# EasyEDA Pro project 5轴PCB-V1.1--捷配.eprj, board PCB
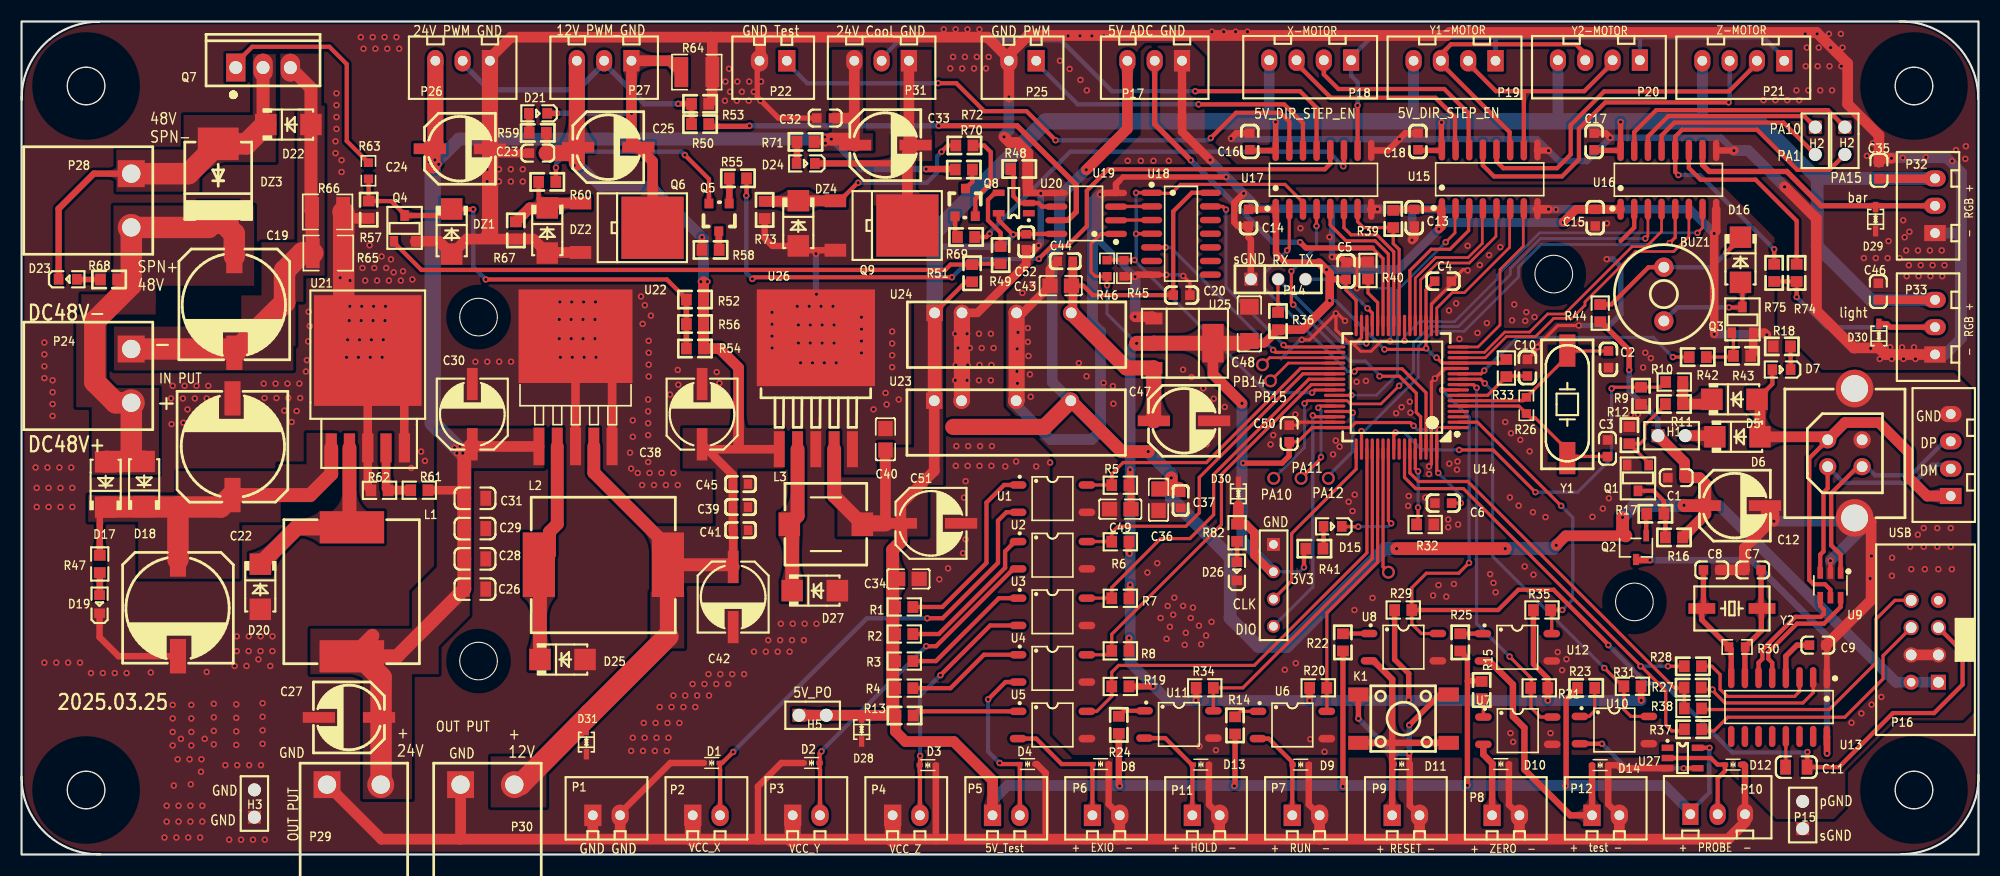
[diagram p2: board, top side]
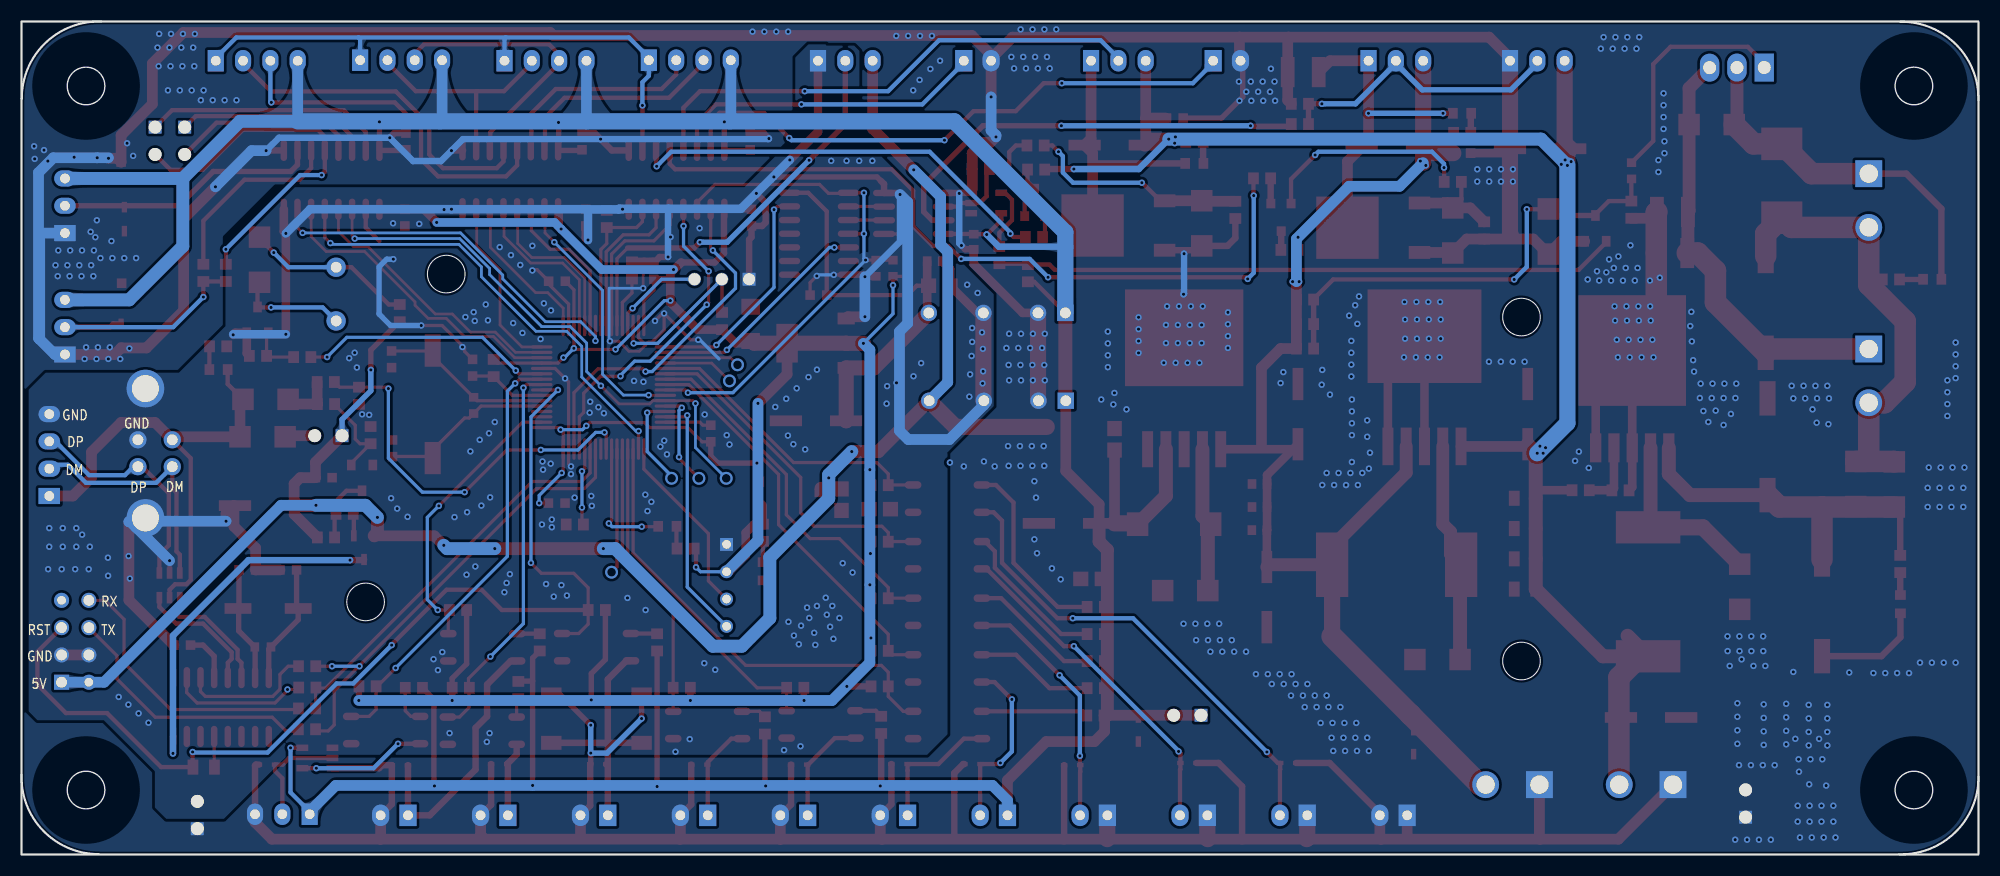
[diagram p3: board, bottom side, seen from below]

Outline 182.01 x 77.5 mm; copper layers: Top Layer, Bottom Layer. Coordinates in mm from the lower left corner of the outline.
Outline path: rectangle 0.01,77.5 182.01,0 ; circle c6.01,71.5 r1.75 ; circle c6.01,6 r1.75 ; circle c42.51,50 r1.75 ; circle c42.51,18 r1.75 ; circle c142.51,54 r1.75 ; circle c150.01,23.5 r1.75 ; circle c176.01,71.5 r1.75 ; circle c176.01,6 r1.75 ; 0.01,70.15 arc(2.08,75.35) 7.26,77.48 ; 7.37,0.02 arc(2.15,2.08) 0,7.25 ; 174.63,77.5 arc(179.84,75.45) 181.99,70.29 ; 182.01,7.41 arc(179.98,2.2) 174.81,0.03
Stack: Top Layer 0.035mm / Dielectric1 1.51mm FR4 er 4.5 / Bottom Layer 0.035mm

## Design rules (mm)
net USB_DP_1: DP1
net USB_DM_1: DP1
template: 用户自定义配置
spacing Default (default): track to track 0.152, other pairs 0 to 0.152
track width Default (default): min 0.254, default 0.254, max 25.4
differential pair differentialPair (default): width min 0.127, default 0.254, max 2.54; gap min 0.152, default 0.152
via Default (default): diameter min 0.25, default 0.61, max 100.025; hole min 0.2, default 0.305, max 59.995

## Placement (name value [footprint] x y rotation side)
BUZ1  HNR-1255PA5.0  [BUZ-TH_BD12.5-P5.00-D0.9]  152.75 52.14 270 top
C1  104  [0603C]  153.89 35.06 0 top
C2  100pF  [0603C]  147.59 46.07 270 top
C3  100pF  [0603C]  147.5 37.79 90 top
C4  104  [0603C]  132.21 53.34 180 top
C5  104  [0603C]  123.19 54.29 270 top
C6  104  [0603C]  132.23 32.69 0 top
C7  18pF  [0603C]  161.01 26.48 180 top
C8  18pF  [0603C]  157.2 26.48 0 top
C9  104  [0603C]  167.06 19.48 0 top
C10  104  [0603C]  140.06 45.29 270 top
C11  104  [0805C]  165.06 8.13 0 top
C12  100uF/35V  [电解电容贴片6X6]  159.35 32.46 0 top
C13  104  [0603C]  129.53 59.25 270 top
C14  104  [0603C]  114.12 59.25 270 top
C15  104  [0603C]  146.36 59.25 270 top
C16  104  [0603C]  114.24 66.34 270 top
C17  104  [0603C]  146.26 66.34 270 top
C18  104  [0603C]  129.88 66.34 270 top
C19  100uF/63V  [电解电容贴片10x10]  19.69 51.44 270 top
C20  104  [0603C]  107.89 52.04 180 top
C21  100uF/63V  [电解电容贴片10x10]  19.72 37.68 90 top
C22  100uF/63V  [电解电容贴片10x10]  14.46 23.21 270 top
C23  104  [0603C]  48.02 65.25 0 top
C24  100uF/35V  [电解电容贴片6X6]  40.77 65.66 0 top
C25  100uF/35V  [电解电容贴片6X6]  54.57 65.81 0 top
C26  104  [0805C]  42.18 24.69 180 top
C27  100uF/35V  [电解电容贴片6X6]  30.45 12.75 180 top
C28  105  [0805C]  42.18 27.51 0 top
C29  105  [0805C]  42.18 30.32 0 top
C30  100uF/35V  [电解电容贴片6x6]  41.93 40.97 90 top
C31  105  [0805C]  42.18 33.14 180 top
C32  104  [0603C]  74.74 68.52 0 top
C33  100uF/35V  [电解电容贴片6X6]  80.34 66 0 top
C34  4.7uF  [C0805]  82.49 25.64 180 top
C35  104  [0603C]  172.75 63.65 270 top
C36  4.7uF  [C0805]  105.75 33.01 90 top
C37  104  [C0603]  107.81 32.95 90 top
C38  100uF/35V  [电解电容贴片6x6]  63.3 40.97 90 top
C39  104  [C0603]  66.87 32.33 180 top
C40  4.7uF  [C0805]  80.35 38.63 270 top
C41  105  [C0603]  66.88 30.18 0 top
C42  100uF/35V  [电解电容贴片6x6]  66.19 23.95 270 top
C43  4.7uF  [C0805]  96.65 52.92 0 top
C44  104  [C0603]  97.08 55.2 0 top
C45  105  [C0603]  66.87 34.47 180 top
C46  104  [0603C]  172.69 52.38 270 top
C47  100uF/35V  [电解电容贴片6X6]  108.12 40.35 0 top
C48  4.7uF  [C1206]  114.2 49.37 270 top
C49  4.7uF  [C0805]  102.19 32.13 0 top
C50  104  [0603C]  117.9 39.17 270 top
C51  100uF/35V  [电解电容贴片6x6]  84.59 30.81 0 top
C52  104  [C0603]  93.45 57.01 90 top
D1  ESD05V52D-C  [SOD-523_L1.2-W0.8-LS1.6-BI]  64.19 8.52 180 top
D2  ESD05V52D-C  [SOD-523_L1.2-W0.8-LS1.6-BI]  73.48 8.52 180 top
D3  ESD05V52D-C  [SOD-523_L1.2-W0.8-LS1.6-BI]  84.29 8.31 0 top
D4  ESD05V52D-C  [SOD-523_L1.2-W0.8-LS1.6-BI]  93.57 8.41 0 top
D5  SS56  [SMA]  159.31 42.35 0 top
D6  SS56  [SMA]  159.59 38.86 0 top
D7  红光  [0603LED]  163.72 45.14 0 top
D8  ESD05V52D-C  [SOD-523_L1.2-W0.8-LS1.6-BI]  100.35 8.41 180 top
D9  ESD05V52D-C  [SOD-523_L1.2-W0.8-LS1.6-BI]  118.97 8.36 180 top
D10  ESD05V52D-C  [SOD-523_L1.2-W0.8-LS1.6-BI]  137.59 8.41 180 top
D11  ESD05V52D-C  [SOD-523_L1.2-W0.8-LS1.6-BI]  128.37 8.4 180 top
D12  ESD05V52D-C  [SOD-523_L1.2-W0.8-LS1.6-BI]  159.18 8.36 180 top
D13  ESD05V52D-C  [SOD-523_L1.2-W0.8-LS1.6-BI]  109.69 8.36 180 top
D14  ESD05V52D-C  [SOD-523_L1.2-W0.8-LS1.6-BI]  146.82 8.31 180 top
D15  绿光  [0603LED]  121.98 30.55 0 top
D16  1N4148  [SMA]  159.87 55.34 270 top
D17  SS56  [SMA]  7.83 34.43 90 top
D18  SS56  [SMA]  11.41 34.47 90 top
D19  红光  [0603LED]  7.28 23.26 270 top
D20  SS56  [SMA]  22.21 24.91 270 top
D21  绿光  [0603LED]  48.07 68.98 0 top
D22  SS56  [SMA]  24.82 67.91 0 top
D23  -̹-  [0603LED]  4.27 53.5 180 top
D24  绿光  [0603LED]  72.97 64.31 0 top
D25  SS56  [SMA]  50.32 18.14 0 top
D26  红光  [0603LED]  113.05 26.32 270 top
D27  SS56  [SMA]  73.78 24.55 0 top
D28  PESD5V0S1BLN  [SOD-323_L1.8-W1.3-LS2.5-BI]  78.14 11.63 270 top
D29  PESD5V0S1BLN  [SOD-323_L1.8-W1.3-LS2.5-BI]  172.44 59.11 270 top
D30  PESD5V0L1BA-N  [SOD-323_L1.8-W1.3-LS2.5-BI]  172.75 48.25 270 top
D30#2  -  [SOD-323_L1.8-W1.3-LS2.5-BI]  113.18 33.56 90 top
D31  PESD3V3L1BA-N  [SOD-323_L1.8-W1.3-LS2.5-BI]  52.54 10.46 270 top
DZ1  --ѹ------SMAZ10V  [SMA]  40.01 57.96 270 top
DZ2  --ѹ------SMAZ10V  [SMA]  48.9 58.06 270 top
DZ3  RS5M  [SMC]  18.29 62.68 90 top
DZ4  --ѹ------SMAZ10V  [SMA]  72.24 58.72 270 top
H1  PZ254V-11-02P  [HDR-TH_2P-P2.54-V-M]  153.47 38.96 0 top
H2  PZ254V-11-02P  [HDR-TH_2P-P2.54-V-M]  169.58 66.4 270 top
H2#2  -  [HDR-TH_2P-P2.54-V-M]  166.83 66.4 270 top
H3  PZ254V-11-02P  [HDR-TH_2P-P2.54-V-M]  21.66 4.74 90 top
H5  PZ254V-11-02P  [HDR-TH_2P-P2.54-V-M]  73.58 12.95 0 top
K1  SW_6X6_H=12.0MM  [KEY-SMD_4P-L6.0-W6.0-P4.50-LS9.0]  128.54 12.64 0 top
L1  47uH/5A  [IND-SMD_L13.45-W12.6]  30.73 24.44 270 top
L2  33uH  [IND-SMD_L13.45-W12.6]  54.12 26.96 0 top
L3  33uH  [IND-SMD_L7.0-W7.0_SMDRI74-330MT]  74.81 30.73 0 top
NOREF  -  [USB-B-TH_USB-B12-BRW]  169.58 37.33 90 top
P1  2P  [HDR1X2_CON]  54.41 3.65 0 top
P2  2P  [HDR1X2_CON]  63.7 3.65 0 top
P3  2P  [HDR1X2_CON]  72.99 3.65 0 top
P4  2P  [HDR1X2_CON]  82.29 3.65 0 top
P5  2P  [HDR1X2_CON]  91.58 3.65 0 top
P6  2P  [HDR1X2_CON]  100.87 3.65 0 top
P7  2P  [HDR1X2_CON]  119.46 3.65 0 top
P8  2P  [HDR1X2_CON]  138.04 3.65 0 top
P9  2P  [HDR1X2_CON]  128.75 3.65 0 top
P10  2P  [HDR1X3_CON]  157.75 3.75 0 top
P11  2P  [HDR1X2_CON]  110.16 3.65 0 top
P12  2P  [HDR1X2_CON]  147.34 3.65 0 top
P14  PZ254V-11-03P  [HDR-TH_3P-P2.54-V-M]  116.88 53.52 0 top
P15  PZ254V-11-03P  [HDR-TH_2P-P2.54-V-M]  165.66 3.67 90 top
P16  8P  [IDC8]  177.26 19.84 90 top
P17  3P  [HDR1X3_CON]  105.39 73.85 180 top
P18  4P  [HDR1X4_CON]  123.66 73.9 180 top
P19  4P  [HDR1X4_CON]  137.09 73.85 180 top
P20  4P  [HDR1X4_CON]  150.51 73.9 180 top
P21  4P  [HDR1X4_CON]  163.94 73.85 180 top
P22  2P  [HDR1X2_CON]  69.91 73.85 180 top
P23  4P  [SIP4]  116.44 28.85 270 top
P24  DB2ER-5.0-2P-GN  [CONN-TH_2P-P5.00_DB2ER-5.0-2P-GN]  10.21 44.53 270 top
P25  2P  [HDR1X2_CON]  93.1 73.85 180 top
P26  3P  [HDR1X3_CON]  41.03 73.85 180 top
P27  3P  [HDR1X3_CON]  54.19 73.85 180 top
P28  DB2ER-5.0-2P-GN  [CONN-TH_2P-P5.00_DB2ER-5.0-2P-GN]  10.21 60.84 270 top
P29  DB2ER-5.0-2P-GN  [CONN-TH_2P-P5.00_DB2ER-5.0-2P-GN]  30.91 6.5 0 top
P30  DB2ER-5.0-2P-GN  [CONN-TH_2P-P5.00_DB2ER-5.0-2P-GN]  43.34 6.5 0 top
P31  3P  [HDR1X3_CON]  79.99 73.85 180 top
P32  3P  [HDR1X3_CON]  177.97 60.36 90 top
P33  3P  [HDR1X3_CON]  177.97 49.06 90 top
Q1  SS8050  [SOT-23]  150.34 35.04 180 top
Q2  AO3401  [SOT-23-3_L3.0-W1.7-P0.95-LS2.9-BR]  150.15 28.55 90 top
Q3  SS8050  [SOT-23]  160.06 49.74 0 top
Q4  SS8050  [SOT-23]  35.63 58.25 0 top
Q5  SS8050  [SOT-23#2]  65.82 60.56 180 top
Q6  F50N06 (FR9024N)  [TO-252]  54.59 58.31 270 top
Q7  IRFB4110PBF/不贴  [TO-220-3_L10.0-W4.5-P2.54-L]  22.47 73.21 0 top
Q8  SS8050  [SOT-23#2]  86.83 59.39 0 top
Q9  F50N06 (FR9024N)  [TO-252]  78.29 58.52 270 top
R1  1K  [0603R]  82.1 23.03 0 top
R2  1K  [0603R]  82.1 20.51 0 top
R3  1K  [0603R]  82.1 17.99 0 top
R4  1K  [0603R]  82.1 15.47 0 top
R5  10K  [0603R]  102.2 34.36 180 top
R6  10K  [0603R]  102.2 29.1 180 top
R7  10K  [0603R]  102.2 23.84 180 top
R8  10K  [0603R]  102.2 18.95 180 top
R9  10K  [0603R]  150.62 42.68 270 top
R10  5.1K  [0603R]  153.71 43.96 180 top
R11  2K  [0603R]  153.69 41.91 0 top
R12  10K  [0603R]  149.54 39.02 270 top
R13  1K  [0603R]  82.13 12.93 0 top
R14  1K  [0603R]  112.87 12.01 90 top
R15  1K  [0603R]  135.8 15.3 270 top
R16  10K  [0603R]  153.69 29.5 0 top
R17  1K  [0603R]  151.96 31.69 0 top
R18  20K  [0603R]  163.72 47.28 180 top
R19  10K  [0603R]  102.2 15.64 180 top
R20  10K  [0603R]  120.6 15.5 0 top
R21  10K  [0603R]  141.16 15.5 180 top
R22  1K  [0603R]  122.9 19.74 90 top
R23  1K  [0603R]  145.52 15.5 0 top
R24  1K  [0603R]  102.06 12.06 90 top
R25  1K  [0603R]  133.81 19.74 90 top
R26  1M  [R0603]  139.96 41.78 90 top
R27  510Ω  [0603R]  155.42 15.53 180 top
R28  510Ω  [0603R]  155.44 17.52 180 top
R29  10K  [0603R]  128.51 22.75 0 top
R30  1M  [R0603]  159.56 19.31 0 top
R31  10K  [0603R]  149.83 15.65 180 top
R32  10K  [0603R]  130.55 30.7 180 top
R33  10K  [0603R]  138.1 45.26 270 top
R34  10K  [0603R]  110.04 15.5 0 top
R35  10K  [0603R]  141.41 22.75 0 top
R36  10K  [0603R]  116.86 49.63 270 top
R37  510Ω  [0603R]  155.46 11.65 0 top
R38  510Ω  [0603R]  155.45 13.59 0 top
R39  10K  [0603R]  127.58 59.13 90 top
R40  10K  [0603R]  125.23 54.34 90 top
R41  50K  [0603R]  120.24 28.46 180 top
R42  2K  [0603R]  155.9 46.28 180 top
R43  10K  [0603R]  160.02 46.39 0 top
R44  5.1K  [0603R]  146.83 50.37 270 top
R45  10K  [R0603]  102.54 54.54 90 top
R46  10K  [R0603]  100.96 54.54 270 top
R47  10K  [0603R]  7.28 27.03 90 top
R48  10K  [0603R]  92.8 63.77 0 top
R49  100  [0603R]  91.06 55.77 270 top
R50  100  [0603R]  63.11 67.95 180 top
R51  10K  [0603R]  88.41 54.08 270 top
R52  20K  [0603R]  62.64 51.63 0 top
R53  10K  [0603R]  63.11 69.84 180 top
R54  20K  [0603R]  62.64 47.07 0 top
R55  2K  [0603R]  66.63 62.91 0 top
R56  20K  [0603R]  62.64 49.35 0 top
R57  10K  [0603R]  32.29 59.99 270 top
R58  20K  [0603R]  64.08 56.25 180 top
R59  50K  [0603R]  48.02 67.14 180 top
R60  0Ω  [0603R]  48.89 62.58 0 top
R61  44.2K  [0603R]  37 33.89 0 top
R62  2.37K  [0603R]  33.3 33.88 0 top
R63  100Ω  [R0603]  32.27 63.61 90 top
R64  0Ω/NC  [R1210]  62.81 72.79 0 top
R65  0Ω  [R1210]  28.53 55.96 180 top
R66  0Ω  [R1210]  28.47 59.78 180 top
R67  10K  [0603R]  45.98 58.06 90 top
R68  200K  [0603R]  8.14 53.5 180 top
R69  2K  [0603R]  87.85 57.45 0 top
R70  50K  [0603R]  87.64 63.72 180 top
R71  100K  [0603R]  72.92 66.3 180 top
R72  0Ω  [0603R]  87.69 65.97 0 top
R73  10K  [0603R]  69.12 59.97 90 top
R74  2K  [0603R]  165.1 54.11 90 top
R75  10K  [0603R]  163 54.11 90 top
R82  50K  [0603R]  113.05 29.94 270 top
U1  LTV-357T-C  [SOP-4_L4.4-W3.9-P2.54-LS7.0-TL]  95.89 33.11 0 top
U2  LTV-357T-C  [SOP-4_L4.4-W3.9-P2.54-LS7.0-TL]  95.89 27.84 0 top
U3  LTV-357T-C  [SOP-4_L4.4-W3.9-P2.54-LS7.0-TL]  95.89 22.58 0 top
U4  LTV-357T-C  [SOP-4_L4.4-W3.9-P2.54-LS7.0-TL]  95.89 17.31 0 top
U5  LTV-357T-C  [SOP-4_L4.4-W3.9-P2.54-LS7.0-TL]  95.89 12.05 0 top
U6  LTV-357T-C  [SOP-4_L4.4-W3.9-P2.54-LS7.0-TL]  118.2 12.05 0 top
U7  LTV-357T-C  [SOP-4_L4.4-W3.9-P2.54-LS7.0-TL]  139.16 11.52 0 top
U8  LTV-357T-C  [SOP-4_L4.4-W3.9-P2.54-LS7.0-TL]  128.53 19.29 0 top
U9  MSUSBLC6-2SC6  [SOT-23-6_L2.9-W1.6-P0.95-LS2.8-BL]  168.24 25.04 180 top
U10  LTV-357T-C  [SOP-4_L4.4-W3.9-P2.54-LS7.0-TL]  148.14 11.58 0 top
U11  LTV-357T-C  [SOP-4_L4.4-W3.9-P2.54-LS7.0-TL]  107.65 12.1 0 top
U12  LTV-357T-C  [SOP-4_L4.4-W3.9-P2.54-LS7.0-TL]  139.12 19.28 0 top
U13  CH340G  [SOIC-16_L9.9-W3.9-P1.27-LS6.0-BL]  163.46 13.72 180 top
U14  STM32F103RCT6  [LQFP-64_L10.0-W10.0-P0.50-LS12.0-BL]  127.88 43.47 90 top
U15  CA-IS3760  [SOIC-16_L9.9-W3.9-P1.27-LS6.0-BL]  136.55 62.82 0 top
U16  CA-IS3760  [SOIC-16_L9.9-W3.9-P1.27-LS6.0-BL]  153.17 62.77 0 top
U17  CA-IS3760  [SOIC-16_L9.9-W3.9-P1.27-LS6.0-BL]  121.09 62.77 0 top
U18  CD4066B  [SOP-14_L8.6-W3.9-P1.27-LS6.0-BL]  107.84 57.75 270 top
U19  CA-IS3720LS  [SOIC-8_L4.9-W3.9-P1.27-LS6.0-BL]  99.02 59.64 90 top
U20  74LVC1G04  [SOT-23-5]  92.28 60.61 180 top
U21  LM2576HVS-ADJ  [TO-263]  32.2 42.36 0 top
U22  LM2596S-12  [TO-263-5_L10.2-W8.6-P1.70-LS14.4-BR]  51.53 43.09 270 top
U23  B0505LS-1WR3  [PWRM-TH_BXXXXLS-1WR3]  91.24 42.22 0 top
U24  B0505LS-1WR3  [PWRM-TH_BXXXXLS-1WR3]  91.28 50.39 0 top
U25  1117-3.3  [SOT-223]  108.01 47.57 270 top
U26  LM2596S-5.0RG  [TO-263-5_L10.1-W8.7-P1.70-LS15.2-BR]  73.88 42.89 270 top
U27  74LVC1G04  [SOT-23-5]  154.49 8.98 0 top
USB  4P  [HDR1X4_CON]  179.43 33.35 90 top
Y1  8M  [晶振贴片]  143.77 41.88 90 top
Y2  12M  [晶振贴片49SSMD]  159.08 22.89 0 top

## Footprints (pads in the part's own frame, mm; a bottom-side part is the same pattern mirrored in y, then rotated)
0603C
  rect 0.889x0.889 smd: 1(-0.774,0) 2(0.774,0)
0603LED
  rect 0.9x1 smd: 1(-0.884,-0.017) 2(0.816,-0.017)
0603R
  rect 1x1.1 smd: 1(-0.8,0) 2(0.8,0)
0805C
  rect 1x1.4 smd: 1(-1,0) 2(1,0)
BUZ-TH_BD12.5-P5.00-D0.9
  round 1.8 hole 1: 1(-2.5,0) 2(2.5,0)
C0603
  rect 0.8x0.9 smd: 1(-0.7,0) 2(0.7,0)
C0805
  rect 1.41x1.35 smd: 1(-1,0) 2(1,0)
C1206
  rect 1.485x1.728 smd: 1(-1.593,0) 2(1.593,0)
CONN-TH_2P-P5.00_DB2ER-5.0-2P-GN
  rect 2.5x2.5 hole 1.7: 1(-2.5,0)
  round 2.5 hole 1.7: 2(2.5,0)
HDR1X2_CON
  rect 1.6x2 hole 0.9: 1(-1.27,0)
  oval 1.6x2 hole 0.9: 2(1.27,0)
HDR1X3_CON
  rect 1.5x2 hole 0.9: 1(-2.54,0)
  oval 1.5x2 hole 0.9: 2(0,0) 3(2.54,0)
HDR1X4_CON
  rect 1.5x2 hole 0.9: 1(0,0)
  oval 1.5x2 hole 0.9: 2(2.54,0) 3(5.08,0) 4(7.62,0)
HDR-TH_2P-P2.54-V-M
  rect 1.2x1.2 hole 1.2x0.8: 1(-1.27,0)
  round 1.2 hole 1.2x0.8: 2(1.27,0)
HDR-TH_3P-P2.54-V-M
  rect 1.2x1.2 hole 1.1x0.8: 1(-2.54,0)
  round 1.2 hole 1.1x0.8: 2(0,0) 3(2.54,0)
IDC8
  rect 1.4x1.4 hole 1: 1(-3.812,-1.019)
  round 1.4 hole 0.8: 2(-3.812,1.521) 7(3.808,-1.019)
  round 1.4 hole 1: 3(-1.272,-1.019) 4(-1.272,1.521) 5(1.268,-1.019) 6(1.268,1.521) 8(3.808,1.521)
IND-SMD_L7.0-W7.0_SMDRI74-330MT
  rect 2x2.2 smd: 1(-3.4,0) 2(3.4,0)
IND-SMD_L13.45-W12.6
  rect 3x6 smd: 1(-6,0) 2(6,0)
KEY-SMD_4P-L6.0-W6.0-P4.50-LS9.0
  rect 1.9x1.3 smd: 1(-4.2,2.25) 2(4.2,2.25) 3(-4.2,-2.25) 4(4.2,-2.25)
LQFP-64_L10.0-W10.0-P0.50-LS12.0-BL
  oval 0.3x2 smd: 1(-3.75,-5.75) 2(-3.25,-5.75) 3(-2.75,-5.75) 4(-2.25,-5.75) 5(-1.75,-5.75) 6(-1.25,-5.75) 7(-0.75,-5.75) 8(-0.25,-5.75) 9(0.25,-5.75) 10(0.75,-5.75) 11(1.25,-5.75) 12(1.75,-5.75) 13(2.25,-5.75) 14(2.75,-5.75) 15(3.25,-5.75) 16(3.75,-5.75) 33(3.75,5.75) 34(3.25,5.75) 35(2.75,5.75) 36(2.25,5.75) 37(1.75,5.75) 38(1.25,5.75) 39(0.75,5.75) 40(0.25,5.75) 41(-0.25,5.75) 42(-0.75,5.75) 43(-1.25,5.75) 44(-1.75,5.75) 45(-2.25,5.75) 46(-2.75,5.75) 47(-3.25,5.75) 48(-3.75,5.75)
  oval 2x0.3 smd: 17(5.75,-3.75) 18(5.75,-3.25) 19(5.75,-2.75) 20(5.75,-2.25) 21(5.75,-1.75) 22(5.75,-1.25) 23(5.75,-0.75) 24(5.75,-0.25) 25(5.75,0.25) 26(5.75,0.75) 27(5.75,1.25) 28(5.75,1.75) 29(5.75,2.25) 30(5.75,2.75) 31(5.75,3.25) 32(5.75,3.75) 49(-5.75,3.75) 50(-5.75,3.25) 51(-5.75,2.75) 52(-5.75,2.25) 53(-5.75,1.75) 54(-5.75,1.25) 55(-5.75,0.75) 56(-5.75,0.25) 57(-5.75,-0.25) 58(-5.75,-0.75) 59(-5.75,-1.25) 60(-5.75,-1.75) 61(-5.75,-2.25) 62(-5.75,-2.75) 63(-5.75,-3.25) 64(-5.75,-3.75)
PWRM-TH_BXXXXLS-1WR3
  rect 1.524x1.524 hole 1: 1(-6.35,0)
  round 1.524 hole 1: 2(-3.81,0) 4(1.27,0) 6(6.35,0)
R0603
  rect 0.806x0.864 smd: 1(-0.753,0) 2(0.753,0)
R1210
  rect 1.282x2.808 smd: 1(-1.441,0) 2(1.441,0)
SIP4
  rect 1.2x1.2 hole 0.8: 1(0,0)
  round 1.2 hole 0.8: 2(2.54,0) 3(5.08,0) 4(7.62,0)
SMA
  rect 2x2 smd: 1(2.1,0) 2(-2.1,0)
SMC
  rect 3.03x3.82 smd: 1(3.435,0) 2(-3.435,0)
SOD-323_L1.8-W1.3-LS2.5-BI
  rect 0.986x0.49 smd: 1(-1.117,0) 2(1.117,0)
SOD-523_L1.2-W0.8-LS1.6-BI
  rect 0.6x0.4 smd: 1(-0.75,0) 2(0.75,0)
SOIC-8_L4.9-W3.9-P1.27-LS6.0-BL
  oval 0.588x2.045 smd: 1(-1.905,-2.772) 2(-0.635,-2.772) 3(0.635,-2.772) 4(1.905,-2.772) 5(1.905,2.772) 6(0.635,2.772) 7(-0.635,2.772) 8(-1.905,2.772)
SOIC-16_L9.9-W3.9-P1.27-LS6.0-BL
  oval 0.602x1.971 smd: 1(-4.445,-2.736) 2(-3.175,-2.736) 3(-1.905,-2.736) 4(-0.635,-2.736) 5(0.635,-2.736) 6(1.905,-2.736) 7(3.175,-2.736) 8(4.445,-2.736) 9(4.445,2.736) 10(3.175,2.736) 11(1.905,2.736) 12(0.635,2.736) 13(-0.635,2.736) 14(-1.905,2.736) 15(-3.175,2.736) 16(-4.445,2.736)
SOP-4_L4.4-W3.9-P2.54-LS7.0-TL
  oval 1.55x0.7 smd: 1(-3.2,1.27) 2(-3.2,-1.27) 3(3.2,-1.27) 4(3.2,1.27)
SOP-14_L8.6-W3.9-P1.27-LS6.0-BL
  oval 0.595x1.968 smd: 1(-3.81,-2.734) 2(-2.54,-2.734) 3(-1.27,-2.734) 4(0,-2.734) 5(1.27,-2.734) 6(2.54,-2.734) 7(3.81,-2.734) 8(3.81,2.734) 9(2.54,2.734) 10(1.27,2.734) 11(0,2.734) 12(-1.27,2.734) 13(-2.54,2.734) 14(-3.81,2.734)
SOT-23
  rect 0.8x1 smd: 1(-1,-1.2) 2(0,1.2) 3(1,-1.2)
SOT-23#2
  rect 0.838x0.889 smd: 1(0,0) 2(1.879,0) 3(0.965,2.566)
SOT-23-3_L3.0-W1.7-P0.95-LS2.9-BR
  rect 1.038x0.532 smd: 1(1.101,-0.95) 2(1.101,0.95) 3(-1.101,0)
SOT-23-5
  rect 1.1x0.6 smd: 1(-1.4,0.95) 2(-1.4,0) 3(-1.4,-0.95) 4(1.4,-0.95) 5(1.4,0.95)
SOT-23-6_L2.9-W1.6-P0.95-LS2.8-BL
  rect 0.532x1.072 smd: 1(-0.95,-1.149) 2(0,-1.149) 3(0.95,-1.149) 4(0.95,1.149) 5(0,1.149) 6(-0.95,1.149)
SOT-223
  rect 1.1x1.6 smd: 1(-2.3,-2.7) 2(0,-2.7) 3(2.3,-2.7)
  rect 3.6x2 smd: 4(0,2.8)
TO-220-3_L10.0-W4.5-P2.54-L
  rect 1.8x2.6 hole 1.2: 1(-2.54,0.005)
  oval 1.8x2.6 hole 1.2: 2(0,0.005) 3(2.54,-0.005)
TO-252
  rect 1.2x2 smd: 1(-2.3,-2.6) 3(2.3,-2.6)
  rect 5.8x5.8 smd: 2(0,4.1)
TO-263
  rect 1.05x2.7 smd: 1(-3.4,-4.526) 2(-1.7,-4.526) 3(0,-4.526) 4(1.7,-4.526) 5(3.4,-4.526)
  rect 10x10.3 smd: 3(0,4.526)
TO-263-5_L10.1-W8.7-P1.70-LS15.2-BR
  rect 3.358x1.02 smd: 1(5.183,-3.4) 2(5.183,-1.7) 3(5.183,0) 4(5.183,1.7) 5(5.183,3.4)
  rect 9x11 smd: 6(-5.184,0)
TO-263-5_L10.2-W8.6-P1.70-LS14.4-BR
  rect 3.5x1.02 smd: 1(5.127,-3.4) 2(5.127,-1.7) 3(5.127,0) 4(5.127,1.7) 5(5.127,3.4)
  rect 8.705x10.587 smd: 6(-5.127,0)
USB-B-TH_USB-B12-BRW
  round 1.6 hole 1: 1(1.25,1.6) 2(-1.25,1.6) 3(-1.25,-1.6) 4(1.25,-1.6)
  round 3.5 hole 2.5: 5(-6.02,-0.9) 6(6.02,-0.9)
晶振贴片
  rect 3x1.5 smd: 1(-5,0) 2(5,0)
晶振贴片49SSMD
  rect 2.5x1 smd: 1(-2.8,0) 2(2.8,0)
电解电容贴片6x6
  rect 3x1 smd: 1(-2.8,0) 2(2.8,0)
电解电容贴片6X6
  rect 3x1 smd: 1(-2.8,0) 2(2.8,0)
电解电容贴片10x10
  rect 3.2x1.5 smd: 1(-4.242,0.097) 2(4.758,0.097)

## Nets
3V3: C4.2 C5.2 C6.2 C13.1 C14.1 C15.1 C48.2 C49.2 C50.2 D30#2.1 P23.2 R5.1 R6.1 R7.1 R8.1 R19.1 R20.1 R21.1 R29.1 R31.1 R33.1 R34.1 R35.1 R36.2 R39.2 R41.2 R46.2 R82.1 U14.1 U14.13 U14.19 U14.32 U14.48 U14.64 U15.1 U16.1 U17.1 U19.1 U25.2 U25.4
5V_DIS: C1.2 C12.1 C36.2 C37.2 H1.1 P16.1 P16.2 P17.3 Q2.2 R16.2 R44.2 U23.6
5V_MCU: C20.2 C43.2 C44.2 C47.1 U18.14 U24.6 U25.3
5V_VCC: C16.2 C17.2 C18.2 C34.2 C35.2 C40.2 C46.2 C51.1 C52.2 D28.1 H5.1 H5.2 L3.2 P5.1 P10.1 P18.4 P19.4 P20.4 P21.4 P32.3 P33.3 R1.1 R2.1 R3.1 R4.1 R13.1 R14.1 R15.1 R22.1 R23.1 R24.1 R25.1 R51.2 U15.16 U16.16 U17.16 U19.8 U20.5 U23.1 U24.1 U26.4 U27.5
12V: C23.2 C25.1 C38.1 C39.2 C41.1 C42.1 C45.2 D31.1 L2.2 P27.3 P30.2 R52.2 R54.2 R56.2 R58.2 R59.1 U22.4 U26.1
24V: C24.1 C26.2 C27.1 C28.1 C29.1 C30.1 C31.2 C32.2 C33.1 L1.2 P26.3 P29.2 P31.3 R61.2 R70.2 R71.1 U22.1
48V_IN: C21.1 C22.1 D17.2 D18.2 R47.2 U21.1
48V_SPN-: C19.2 D22.1 P24.1 Q7.3 R65.2 R66.2
PGND: C16.1 C17.1 C18.1 C21.2 C22.2 C23.1 C24.2 C26.1 C27.2 C28.2 C29.2 C30.2 C31.1 C32.1 C34.1 C35.1 C38.2 C39.1 C40.1 C41.2 C42.2 C45.1 C46.1 C51.2 C52.1 D1.2 D2.2 D3.2 D4.2 D8.1 D9.1 D10.1 D11.1 D12.1 D13.1 D14.1 D19.2 D20.1 D25.1 D27.1 D28.2 D29.2 D30.2 D31.2 DZ1.1 DZ2.1 DZ4.1 H3.1 H3.2 K1.1 K1.2 P1.1 P1.2 P2.1 P3.1 P4.1 P6.2 P7.2 P8.2 P9.2 P10.3 P11.2 P12.2 P15.1 P22.2 P25.2 P26.1 P29.1 P30.1 P32.1 P33.1 Q4.3 Q6.3 Q9.3 R48.2 R53.1 R57.2 R62.1 R64.2 R65.1 R66.1 R67.1 R73.1 U15.9 U16.9 U17.9 U19.5 U20.3 U21.3 U21.5 U22.3 U22.5 U22.6 U23.2 U24.2 U26.3 U26.5 U26.6 U27.3
SGND: C1.1 C2.2 C3.2 C4.1 C5.1 C6.1 C7.2 C8.2 C9.2 C10.1 C12.2 C13.2 C14.2 C15.2 C20.1 C36.1 C37.1 C43.1 C44.1 C47.2 C48.1 C49.1 C50.1 D26.2 D30#2.2 NOREF.4 NOREF.5 NOREF.6 P14.1 P15.2 P16.3 P16.4 P17.1 P23.1 Q1.3 Q3.3 R9.2 R12.1 R18.2 R32.1 R40.2 R43.2 R45.1 U1.3 U2.3 U3.3 U4.3 U5.3 U6.3 U7.3 U8.3 U9.2 U10.3 U11.3 U12.3 U13.1 U14.12 U14.18 U14.31 U14.47 U14.63 U15.8 U16.8 U17.8 U18.7 U19.4 U23.4 U24.4 U25.1 USB.4
A_LIMT: R8.2 U4.4 U14.40
A_LO: D4.1 P5.2 U4.2
ADC: P17.2 U14.27
BEEP: R42.2 U14.11
BOOT0: R32.2 U14.60
BOOT1: R40.1 U14.28
D+: U14.45
D-: U14.44
DOOR: R35.2 U12.4 U14.2
EXIO: R19.2 U5.4 U14.51
HOLD: R34.2 U11.4 U14.52
I_PROBE: D12.2 P10.2 U27.2
LASER_CD: U18.3 U19.2
LASER_CTRL: U14.26 U17.5
LASER_OUT: R50.1 U19.7
LASER_PO: R55.2 U17.12
LED_SYS: D15.2 U14.55
M_EN_OUT: P18.1 P19.1 P20.1 P21.1 U17.10
MOTOR_EN: R39.1 U14.24 U17.7
MX_DIR: U14.42 U15.2
MX_DIR_OUT: P18.3 U15.15
MX_ST_OUT: P18.2 U15.14
MX_STEP: U14.22 U15.3
MY_DIR: U14.17 U15.6
MY_DIR_OUT: P19.3 P20.3 U15.11
MY_ST_OUT: P19.2 P20.2 U15.10
MY_STEP: U14.16 U15.7
MZ_DIR: U14.21 U15.4
MZ_DIR_OUT: P21.3 U15.13
MZ_ST_OUT: P21.2 U15.12
MZ_STEP: U14.20 U15.5
NRST: C10.2 R33.2 U14.7
PA1: U14.15 U16.4
PA1_OUT: H2#2.2 U16.13
PA10: U14.43 U16.3
PA10_OUT: H2#2.1 U16.14
PA15: H2.2 R75.2 U16.12
PB14: U14.35
PB15: U14.36
PD2: U14.54
PROBE: R31.2 U10.4 U14.10
PUMP_CTRL: U14.25 U17.6
PUMP_PO: R69.2 U17.11
PWM_COOL: U14.61 U17.4
PWM_OUT: P31.2 U17.13
RGB_DATA1: U14.23 U16.7
RGB_DATA2: U14.50 U16.5
RGB_OUT1: D29.1 P32.2 U16.10
RGB_OUT2: D30.1 P33.2 R74.1 R75.1
RGB_P2: U14.14 U16.6
RGB_PO2: R74.2 U16.11
RST: C11.2 P16.5 R29.2 U8.4 U14.8
RUN: R20.2 U6.4 U14.53
RXD: R27.2 R38.1 U14.59
RXD3: P14.2 R36.1 U14.30
SP_PWM_5V: P25.1 U17.14
SPINDLE_CD: U18.2 U19.3
SPINDLE_EN0: U14.33 U18.13
SPINDLE_EN1: U14.34 U18.5
SPINDLE_OUT: R48.1 U19.6 U20.2
SPINDLE_PWM: R45.2 R46.1 U14.41 U17.3 U18.1 U18.4
SPN+: C19.1 D17.1 D18.1 DZ3.2 P24.2 P28.2 R68.1
SPN_PWM: DZ1.2 Q4.2 R52.1 R54.1 R56.1 R57.1 R63.1
SPN_PWM_OUT: Q7.1 R63.2
SWCLK: P23.3 U14.49
SWDIO: P23.4 U14.46
TEST_PWM: P22.1 U17.15
TIM4_CH4: U14.62 U17.2
TXD: R28.2 R37.1 U14.58
TXD3: P14.3 U14.29
USB_CHK: R9.1 R10.2 U14.56
USB_DM: NOREF.2 U9.3 USB.2
USB_DM_1: U9.4 U13.6
USB_DP: NOREF.3 U9.1 USB.3
USB_DP_1: U9.6 U13.5
VCH340: Q2.3 U13.16
VUSB: D5.1 D6.1 D7.1 NOREF.1 U9.5 USB.1
X_LIMT: R5.2 U1.4 U14.37
X_LO: D1.1 P2.2 U1.2
XTAL1: C3.1 R26.1 U14.5 Y1.1
XTAL2: C2.1 R26.2 U14.6 Y1.2
Y_LIMT: R6.2 U2.4 U14.38
Y_LO: D2.1 P3.2 U2.2
Z_LIMT: R7.2 U3.4 U14.39
Z_LO: D3.1 P4.2 U3.2
ZERO: R21.2 U7.4 U14.9
$1N25015: C9.1 U13.4
$1N25025: C11.1 U13.13
$1N25043: C7.1 R30.2 U13.7 Y2.2
$1N25047: C8.1 R30.1 U13.8 Y2.1
$1N25057: Q3.1 R42.1 R43.1
$1N25180: D15.1 R41.1
$1N25225: U14.3
$1N25227: U14.4
$1N25288: P16.6 R37.2
$1N25293: P16.8 R38.2
$1N25300: R1.2 U1.1
$1N25317: Q2.1 R17.1
$1N25319: Q1.2 R16.1 R17.2
$1N25330: R27.1 U13.2
$1N25334: R28.1 U13.3
$1N25342: D7.2 R18.1
$1N25345: Q1.1 R11.1 R12.2
$1N25354: BUZ1.1 D16.2 R44.1
$1N25355: BUZ1.2 D16.1 Q3.2
$1N25359: R24.2 U11.1
$1N25456: R2.2 U2.1
$1N25466: R3.2 U3.1
$1N25476: R4.2 U4.1
$1N25486: D13.2 P11.1 U11.2
$1N25489: R14.2 U6.1
$1N25493: D9.2 P7.1 U6.2
$1N25496: R15.2 U7.1
$1N25501: D10.2 P8.1 U7.2
$1N25504: R25.2 U12.1
$1N25509: D14.2 P12.1 U12.2
$1N25512: R13.2 U5.1
$1N25517: D8.2 P6.1 U5.2
$1N25520: R22.2 U8.1
$1N25525: D11.2 K1.3 K1.4 P9.1 U8.2
$1N25567: D6.2 H1.2
$1N25569: D5.2 R10.1 R11.2
$1N25579: R23.2 U10.1
$1N25584: U10.2 U27.4
$6N26706: D20.2 L1.1 U21.2
$6N26710: R61.1 R62.2 U21.4
$6N26736: D26.1 R82.2
$6N26743: D22.2 D23.2 DZ3.1 P28.1 Q7.2
$6N26746: D23.1 R68.2
$6N26776: D24.1 R71.2
$6N26777: C33.2 D24.2 P31.1 Q9.2
$6N26781: Q8.2 R72.2
$6N26782: DZ4.2 Q9.1 R72.1 R73.2
$6N26787: D21.1 R59.2
$6N26789: DZ2.2 Q6.1 R60.1 R67.2
$6N26790: P26.2 P27.2 R50.2 R53.2
$6N26799: D19.1 R47.1
$6N26802: Q4.1 R49.2 R51.1
$6N26803: R49.1 U20.4
$6N26836: Q8.3 R70.1
$6N26839: Q8.1 R69.1
$6N26845: Q5.3 R58.1
$6N26846: Q5.2 R60.2
$6N26847: Q5.1 R55.1
$6N26878: D27.2 L3.1 U26.2
$6N26882: D25.2 L2.1 U22.2
$6N26906: C25.2 D21.2 P27.1 Q6.2 R64.1

Pads without a net: H2 1; P16 7; U13 9 10 11 12 14 15; U14 57; U16 2 15; U18 6 8 9 10 11 12; U20 1; U27 1

## Via types
v1: diameter 0.6, hole 0.3, Top Layer to Bottom Layer, 774 vias
v2: diameter 1.2, hole 0.8, Top Layer to Bottom Layer, 6 vias

## Routing (per net, layer and track width the routed paths; a pad name or vN(x,y) marks a point on that pad's centre or on a via; arc(x,y) is an arc through that point)
3V3: length 295.2
  Top Layer w0.3: v1(131.61,46.23) 132.12,45.72 U14.13 137.76,45.72 R33.1 ; C50.2 118.71,38.39 120.03,39.72 U14.48 123.6,39.72 124.07,40.19 129.17,40.19 v1(129.48,39.88) ; v1(131.77,35.5) 131.63,35.64 U14.64 131.63,39.28 132.07,39.72 U14.1 ; v1(100.96,52.96) 100.96,53.79 99.87,53.79 99.48,54.18 99.48,56.84 100.38,57.74 U19.1 ; v1(133.86,32.69) C6.2 ; U14.32 124.13,51.57 123.19,52.5 C5.2 ; v1(126.76,46.99) 130.54,46.99 v1(130.64,47.1) 130.63,47.11 U14.19 130.63,52.53 C4.2
  Top Layer w0.4: R41.2 119.28,28.29 v1(119.28,26.72)
  Top Layer w0.5: R29.1 127.71,18.14 129.02,16.83 v1(129.02,14.38) ; 132.05,60.03 129.54,60.03 C13.1 127.67,60.02 R39.2 ; v1(113.61,36.41) 117.24,36.41 117.9,37.08 C50.2 ; R21.1 141.96,16.39 140.61,17.73 R35.1
  Top Layer w0.6: v1(109.23,14.33) 109.24,14.35 R34.1 ; R20.1 v1(119.8,14.33) ; 121.72,53.47 121.76,53.51 C5.2 ; 121.72,53.47 121.67,53.41 ; 121.72,53.47 121.67,53.52 ; R31.1 150.63,14.35 v1(150.64,14.33) ; R7.1 103.11,23.95 v1(103.11,25.09) ; C49.2 103.19,34.17 R5.1 103.11,34.47 v1(103.11,35.8) ; R21.1 v1(141.96,14.33) ; v1(103.01,20.14) 103,20.14 R8.1 ; 120.66,55.08 117.54,55.08 116.67,55.95 116.67,59.98 116.63,60.02 C14.1 ; R6.1 103,28.06 v1(103.06,28) ; R19.1 v1(105.25,15.64)
  Top Layer w0.8: 120.66,55.08 121.67,54.07 121.67,53.52 ; P23.2 116.19,26.31 114.66,27.85 114.66,29.94 113.86,30.74 R82.1 ; v1(143.4,58.8) 143.4,58.85 144.57,60.02 C15.1 146.37,60.03 U16.1 ; 113.87,47.56 115.59,47.56 R36.2 119.13,48.83 121.67,51.37 121.67,53.41 ; v1(131.82,58.19) 132.05,58.42 132.05,60.03
  Top Layer w1: v1(113.51,41.97) 110.81,44.68 U25.4 ; D30#2.1 113.18,30.86 R82.1
  Top Layer w1.4: v1(103.71,47.55) 105.29,47.55 U25.2 U25.4 113.86,47.57 113.87,47.56
  Bottom Layer w0.3: v1(133.86,32.69) 133.86,33.41 v1(131.77,35.5) ; v1(103.71,47.55) 100.96,50.31 v1(100.96,52.96) ; v1(130.64,47.1) 131.5,46.23 v1(131.61,46.23) ; v1(121.66,51.53) 122.22,51.53 v1(126.76,46.99) ; v1(131.87,39.53) 129.83,39.53 v1(129.48,39.88) ; v1(119.28,26.72) 118.86,26.31 P23.2
  Bottom Layer w0.8: v1(143.4,58.8) 132.43,58.8 v1(131.82,58.19) 128.05,54.42 v1(121.37,54.42)
  Bottom Layer w1: P23.2 113.51,29.23 v1(113.51,41.97) ; v1(150.64,14.33) v1(141.96,14.33) v1(119.8,14.33) v1(109.23,14.33) 106.63,14.33 103.11,17.85 v1(103.11,25.09) v1(103.11,35.8) 103.11,46.95 v1(103.71,47.55)
5V_DIS: length 186.5
  Top Layer w0.5: R44.2 146.88,49.57 149.52,46.93 v1(149.52,45.08)
  Top Layer w1: Q2.2 143.62,29.65 v1(142.74,28.76) ; v1(99.03,63.7) 102.85,67.52 P17.3 ; R16.2 156.65,31.66 156.65,34.49 156.08,35.06 C1.2 154.67,36.49 H1.1
  Top Layer w1.2: v1(148.91,31.37) 148.91,29.94 Q2.2 ; U23.6 102.32,37.49 v1(104.79,37.49) ; C36.2 107.59,34.01 107.65,34.07 ; v1(154.62,32.49) 154.65,32.46 156.65,32.46 ; v1(137.99,28.46) v1(127.89,28.46) ; 106.98,34.02 106.93,34.07 v1(106.93,35.04)
  Top Layer w1.5: 86.66,39.78 95.15,39.78 U23.6
  Bottom Layer w0.5: v1(149.52,45.08) 149.52,43.15 152.2,40.47 H1.1
  Bottom Layer w1: U23.6 95.87,43.94 95.87,56.07 96.53,56.73 96.53,61.2 v1(99.03,63.7) ; P16.1 P16.2 174.33,16.03 157.87,32.49 v1(154.62,32.49)
  Bottom Layer w1.2: v1(137.99,28.46) 142.43,28.46 v1(142.74,28.76) ; v1(104.79,37.49) 106.93,35.34 v1(106.93,35.04) 106.93,33.12 112.41,27.64 112.41,21.98 115.01,19.38 117.72,19.38 126.79,28.46 v1(127.89,28.46) ; v1(154.62,32.49) 150.03,32.49 v1(148.91,31.37)
5V_MCU: length 41.4
  Top Layer w0.4: C43.2 98.75,52.92 99.63,52.04 C20.2 107.12,59.84 108.84,61.56 U18.14
  Top Layer w0.8: U24.6 97.78,50.54 C44.2
  Top Layer w1.4: U24.6 102.75,45.27 U25.3 105.31,40.36 C47.1
5V_VCC: length 395.6
  Top Layer w0.4: U20.5 90.89,59 92.18,57.71 C52.2 93.47,57.74 U19.8 ; R51.2 87.82,53.28 U24.1 ; U27.5 v1(156.99,9.93)
  Top Layer w0.5: R14.1 112.87,6.44 v1(112.8,6.38) ; R22.1 v1(122.9,6.32) ; 134.47,16.13 v1(134.47,6.43) ; 134.47,16.13 135.77,16.13 R15.1 ; 134.47,16.13 134.47,18.27 R25.1 ; v1(132.07,68.11) 132.05,68.09 132.05,65.51 129.94,65.51 C18.2 ; C16.2 114.3,65.51 U17.16 v1(116.64,68.16) ; v1(143.6,6.38) 143.65,6.43 143.65,14.44 R23.1 ; v1(148.72,68.16) U16.16 146.32,65.51 C17.2
  Top Layer w0.6: v1(102.14,6.38) 102.06,6.46 R24.1
  Top Layer w0.8: C35.2 177.94,62.87 P32.3 ; C46.2 177.97,51.6
  Top Layer w1: H5.1 H5.2 81.02,12.95 ; P5.1 90.31,6.91 86.71,10.51 82.22,10.51 81.28,11.45 81.28,12.88 R13.1 ; U23.1 84.89,35.69 81.79,32.59 C51.1 ; C40.2 80.35,31.3
  Top Layer w1.2: 81.02,12.95 81.02,28.34 81.79,29.11 C51.1
  Top Layer w1.3: U23.1 84.93,42.26 U24.1 ; L3.2 75.58,33.36 75.58,37.71
  Top Layer w1.5: L3.2 78.29,30.81 80.35,30.81
  Bottom Layer w0.4: v1(156.99,9.93) 156.99,5.77 155.21,4
  Bottom Layer w0.6: 84.93,56.55 91.11,56.55 v1(92.25,57.68)
  Bottom Layer w1: 116.04,73.85 116.04,68.29 116.12,68.21 ; P10.1 155.21,4 152.78,6.43 v1(134.47,6.43) 91.71,6.43 90.31,5.03 P5.1 ; P19.4 129.47,68.25 129.42,68.21 ; 143.1,68.21 142.89,68.41 142.89,73.85 ; 156.33,68.21 156.32,68.21 P21.4
  Bottom Layer w1.2: 167.01,62.9 161.69,68.21 156.33,68.21 ; 167.01,62.9 P32.3 ; 167.01,62.9 167.01,56.59 171.99,51.6 P33.3
  Bottom Layer w1.5: 156.33,68.21 95.24,68.21 84.93,57.89 U24.1
12V: length 117.8
  Top Layer w0.6: 48.84,67.11 48.84,65.25 ; R58.2 v1(63.28,57.43)
  Top Layer w0.8: 70.48,37.71 63.76,37.71 ; 63.76,37.71 66.17,35.3 C45.2 C39.2 66.17,30.2 C41.1 66.19,30.18 C42.1 ; 63.76,37.71 C38.1
  Top Layer w1: 63.44,53.3 R52.2 R56.2 R54.2 64.91,47.07 66.69,45.29 66.69,37.98
  Top Layer w1.2: C42.1 65.98,26.96 L2.2 60.12,28.64 53.23,35.53 U22.4
  Top Layer w1.5: C25.1 51.65,65.93 P27.3 ; 48.84,65.25 51.21,65.25 51.65,65.69 51.65,64.36 ; L2.2 60.12,20.3
  Top Layer w2: 52.86,13.04 46.39,6.5 P30.2 ; 52.86,13.04 52.77,12.95 ; 52.86,13.04 60.12,20.3
  Bottom Layer w1: 63.44,53.3 63.44,57.27 58.53,62.17 53.84,62.17 51.65,64.36
  vias: v1(51.4,64.11) v1(51.91,64.52) v1(63.18,53.3) v1(63.79,53.3)
24V: length 154.3
  Top Layer w0.6: R70.2 86.79,63.77 v1(84.14,63.77) ; R71.1 75.06,66.3 v1(75.31,66.56)
  Top Layer w0.8: R61.2 40.99,33.89
  Top Layer w1: U22.1 42.13,37.97 C30.1 ; P31.3 77.45,68.5 ; 77.45,68.5 77.45,66.08 ; 77.45,68.5 77.44,68.52 75.62,68.52
  Top Layer w1.2: C33.1 76.98,66.56 v1(75.31,66.56)
  Top Layer w1.3: 31.47,18.44 34.93,18.44 C26.2 C28.1 C29.1 C31.2 41.18,37.42 C30.1 ; 32.64,20.35 L1.2
  Top Layer w1.5: v1(38.24,64.11) 38.24,65.4 C24.1 38.49,66.17 P26.3
  Top Layer w2: P29.2 33.44,6.53 33.44,16.47 31.47,18.44 L1.2
  Bottom Layer w0.6: v1(75.31,66.56) 78.1,63.77 v1(84.14,63.77)
  Bottom Layer w1.2: v1(38.24,64.11) 40.68,66.56 v1(75.31,66.56)
  Bottom Layer w1.5: v1(41.04,37.33) 38.24,40.14 v1(38.24,64.11)
  vias: v1(37.89,64.47) v1(38.45,64.62) v1(38.8,64.21) v1(40.26,37.85) v1(40.49,37.33) v1(40.79,37.99) v1(74.69,66.76) v1(74.76,66.17)
48V_IN: length 34.3
  Top Layer w0.6: R47.2 7.28,31.78 D17.2
  Top Layer w1.3: C21.1 26.83,33.44 28.8,35.41 U21.1
  Top Layer w2: 14.54,32.33 18.51,32.33 C21.1 ; 14.54,32.33 14.55,32.31 C22.1 ; 14.54,32.33 D17.2
48V_SPN-: length 40.7
  Top Layer w1.2: 25.01,73.2 26.92,71.3 D22.1 26.92,59.89 R66.2 27.03,56.02 R65.2
  Top Layer w2: R65.2 26.11,55.96 24.47,54.32 24.47,51.36 C19.2 19.44,47.03 P24.1
PGND: length 708.8
  Top Layer w0.5: 68.64,73.85 68.43,73.64 68.43,70.48 70.4,68.52 C32.1 ; D11.1 129.07,8.45 v1(129.07,9.44) ; v1(129.07,12.04) 131.92,14.89 K1.2 ; K1.1 v1(124.34,12.65)
  Top Layer w0.6: 94.84,61.55 U19.5 ; Q9.3 73.9,56.22 ; 73.9,56.22 72.65,56.22 DZ4.1 69.84,56.62 69.12,57.35 R73.1 ; 73.9,56.22 73.9,55.91 v1(73.88,55.9) ; D3.2 85.04,1.46 85.07,1.43 ; P6.2 101.1,4.68 D8.1 ; D2.2 70.67,8.52 68.49,6.33 68.49,1.43 ; P12.2 147.57,4.69 D14.1 148.47,8.31 148.75,8.03 U27.3 ; D12.1 160.2,8.36 160.29,8.27 P10.3 ; P11.2 110.44,4.64 D13.1 ; C18.1 128.71,67.11 v1(128.15,66.56) 127.1,65.51 U17.9 ; P8.2 138.33,4.62 138.33,8.41 ; D4.2 94.42,8.41 95.25,7.58 95.25,1.63 ; v1(112.49,66.61) 113,67.11 C16.1 ; D11.1 129.12,4.55 P9.2 ; v1(94.8,61.51) 94.74,61.56 U20.3 ; C52.1 94.24,56.31 v1(94.59,56.66) ; P7.2 119.72,4.65 D9.1 ; D19.2 7.26,20.21 9.02,18.45 C22.2 ; v1(147.76,66.68) 147.33,67.11 C17.1 ; U16.9 159.28,65.51 ; 55.68,3.84 60.35,8.52 D1.2 ; 140.94,65.51 142,65.51 v1(142.02,65.48)
  Top Layer w0.8: U21.5 35.6,43.48 U21.3 U21.3 32.2,34.17 R62.1 ; 159.28,65.51 v1(159.26,65.48) ; U22.3 U22.6 54.93,44.82 U22.5 ; C23.1 43.98,65.25 C24.2 ; C52.1 93.45,54.94 88.9,50.39 U24.2
  Top Layer w1: 93.59,61.91 R48.2 93.59,65.26 92.6,66.25 91.89,66.25 v1(91.38,66.76) ; 68.74,76.04 64.16,76.04 ; 68.74,76.04 89.84,76.04 91.83,74.05 ; 68.74,76.04 68.74,73.95 68.64,73.85 ; 64.16,76.04 45.51,76.04 43.57,74.1 ; 64.16,76.04 64.25,75.96 R64.2 64.25,70.18 R53.1 ; v1(163.97,62.12) 166.93,59.16 166.93,50.59 170.4,47.13 D30.2 173.35,46.52 P33.1 ; P12.2 148.61,1.44 148.62,1.43 ; R57.2 30.5,59.19 29.97,59.72 ; Q6.3 48.95,56.01 DZ2.1 47.6,57.26 R67.1 41.41,57.26 DZ1.1 38.82,57.05 Q4.3 ; v1(91.83,70.48) 91.83,74.05 ; 91.83,74.05 91.83,74.4 93.62,76.2 132.56,76.2 132.84,76.48 166.96,76.48 169.84,73.59 169.84,69.82 172.75,66.91 C35.1 173.09,64.77 v1(173.92,64.77) ; 148.62,1.43 158.72,1.43 160.29,3 P10.3 ; 148.62,1.43 120.76,1.43 ; P7.2 120.73,1.47 120.76,1.43 ; 55.57,1.43 55.68,1.53 P1.2 ; 55.57,1.43 101.99,1.43 ; 55.57,1.43 40.79,1.43 ; 101.99,1.43 111.43,1.43 ; 101.99,1.43 102.14,1.58 P6.2 ; P11.2 111.43,1.43 111.43,1.43 ; P8.2 139.31,1.83 139.17,1.68 ; 40.79,1.43 33.48,1.43 P29.1 ; 40.79,1.43 40.84,1.48 P30.1 ; 120.76,1.43 111.43,1.43 ; 129.99,1.63 130.02,1.67 P9.2 ; P1.1 53.14,1.73
  Top Layer w1.5: 62.48,1.43 62.43,1.48 P2.1 ; U23.2 87.47,42.26 U24.2 ; P3.1 71.72,1.48 71.68,1.43 ; 81.03,1.43 81.03,3.63 P4.1 ; 43.49,57.63 43.57,57.72 C24.2 43.57,65.67 P26.1
  Top Layer w2: U21.3 29.97,49.12 R65.1 29.97,59.72 R66.1
  Bottom Layer w0.5: v1(129.07,12.04) v1(129.07,9.44) 127.55,9.44 v1(124.34,12.65)
  Bottom Layer w0.6: v1(94.8,61.51) 94.8,56.87 v1(94.59,56.66) ; v1(159.26,65.48) 158.06,66.68 v1(147.76,66.68) 145.59,64.52 142.99,64.52 v1(142.02,65.48) 140.95,66.56 v1(128.15,66.56) 112.54,66.56 v1(112.49,66.61) ; v1(73.88,55.9) 73.88,52.17 v1(73.94,52.12)
  Bottom Layer w1: P33.1 178.9,46.52 180.31,47.93 ; v1(159.26,65.48) 160.61,65.48 v1(163.97,62.12) ; 180.31,47.93 180.43,48.04 180.43,63.45 179.05,64.82 v1(174.97,64.82) 173.92,64.82 ; 180.31,47.93 180.31,57.82 P32.1 ; v1(91.83,70.48) 91.83,67.37 91.38,66.91 v1(91.38,66.76)
  vias: v1(1.31,36.01) v1(1.41,34.11) v1(1.41,32.33) v1(2.13,47.63) v1(2.13,46.53) v1(2.13,45.42) v1(2.13,44.32) v1(2.13,17.85) v1(2.42,36.01) v1(2.52,34.11) v1(2.52,32.33) v1(2.89,44.12) v1(2.89,43.01) v1(2.89,41.91) v1(2.89,40.8) v1(3.23,17.85) v1(3.52,36.01) v1(3.62,34.11) v1(3.62,32.33) v1(4.34,17.85) v1(4.63,36.01) v1(4.73,34.11) v1(4.73,32.33) v1(5.44,17.85) v1(6.46,16.88) v1(7.57,16.88) v1(8.67,16.88) v1(9.78,16.88) v1(12.02,16.93) v1(13.3,1.58) v1(13.5,4.54) v1(13.5,3.06) v1(13.91,42.43) v1(13.96,40.04) v1(14.06,43.61) v1(14.06,13.92) v1(14.06,12.66) v1(14.06,11.4) v1(14.06,10.15) v1(14.17,6.41) v1(14.4,1.58) v1(14.52,8.86) v1(14.6,4.54) v1(14.6,3.06) v1(14.83,10.76) v1(15.01,42.43) v1(15.05,40.17) v1(15.17,43.61) v1(15.44,41.41) v1(15.51,1.58) v1(15.63,8.86) v1(15.74,6.53) v1(15.71,4.54) v1(15.71,3.06) v1(15.79,13.92) v1(15.79,12.66) v1(15.79,11.4) v1(15.79,10.15) v1(16.12,42.43) v1(16.27,43.61) v1(16.61,1.58) v1(16.73,8.86) v1(16.7,7.7) v1(16.82,4.54) v1(16.82,3.06) v1(17.04,10.76) v1(17.22,42.43) v1(17.22,16.98) v1(17.38,43.61) v1(17.88,14.02) v1(17.88,12.76) v1(17.88,11.51) v1(17.88,10.25) v1(18.96,8.31) v1(19.31,1.38) v1(19.82,17.54) v1(20.03,20.3) v1(20.02,18.92) v1(19.98,13.97) v1(19.98,12.71) v1(19.98,11.45) v1(19.98,10.2) v1(20.06,8.31) v1(20.42,1.38) v1(20.93,17.54) v1(21.13,20.3) v1(21.12,18.92) v1(21.17,8.31) v1(21.52,1.38) v1(22.03,18.16) v1(22.24,20.3) v1(22.23,18.92) v1(22.27,8.31) v1(22.42,14.07) v1(22.42,12.81) v1(22.42,11.56) v1(22.42,10.3) v1(22.53,43.81) v1(22.6,42.47) v1(22.63,1.38) v1(23.03,40.99) v1(23.14,17.54) v1(23.34,20.3) v1(23.33,18.92) v1(23.63,43.81) v1(23.71,42.47) v1(23.71,39.96) v1(24.44,41.3) v1(24.74,43.81) v1(24.81,42.47) v1(25.13,40.24) v1(25.59,41.26) v1(25.84,43.81) v1(25.92,42.47) v1(26.54,45.99) v1(26.45,44.93) v1(26.71,50.49) v1(26.66,47.74) v1(26.81,49.16) v1(29.21,66.35) v1(29.21,65.25) v1(29.29,70.82) v1(29.29,69.71) v1(29.29,68.61) v1(29.29,67.5) v1(29.64,53.66) v1(29.77,64.6) v1(29.77,63.5) v1(30.23,46.26) v1(30.33,47.89) v1(30.53,51) v1(30.48,49.67) v1(30.56,53.4) v1(31.33,46.26) v1(31.44,47.89) v1(31.55,76.04) v1(31.64,51) v1(31.59,49.67) v1(31.71,54.57) v1(31.81,74.97) v1(31.96,53.4) v1(32.37,56.68) v1(32.44,46.26) v1(32.54,47.89) v1(32.66,76.04) v1(32.74,51) v1(32.69,49.67) v1(32.81,54.57) v1(32.91,74.97) v1(33.07,53.4) v1(33.49,55.64) v1(33.54,46.26) v1(33.65,47.89) v1(33.76,76.04) v1(33.85,51) v1(33.8,49.67) v1(33.92,54.57) v1(34.02,74.97) v1(34.17,53.4) v1(34.36,55.37) v1(34.61,54.16) v1(34.87,76.04) v1(35.12,74.97) v1(35.28,53.4) v1(35.48,54.26) v1(36.25,35.96) v1(36.35,53.5) v1(37.16,37.49) v1(37.52,36.62) v1(42.21,45.85) v1(43.3,63.75) v1(43.3,62.61) v1(43.32,45.85) v1(44.41,63.75) v1(44.41,62.61) v1(44.42,45.85) v1(45.51,63.75) v1(45.51,62.61) v1(45.53,45.85) v1(46.62,63.75) v1(46.62,62.61) v1(50.02,49.78) v1(50.02,47.99) v1(50.07,51.41) v1(50.12,46.26) v1(51.12,49.78) v1(51.12,47.99) v1(51.17,51.41) v1(51.22,46.26) v1(52.23,49.78) v1(52.23,47.99) v1(52.28,51.41) v1(52.33,46.26) v1(53.33,49.78) v1(53.33,47.99) v1(53.38,51.41) v1(53.43,46.26) v1(56.6,37.38) v1(56.7,35.9) v1(56.7,9.64) v1(56.85,40.39) v1(56.85,38.86) v1(56.85,10.86) v1(57.31,35.5) v1(57.62,51.92) v1(57.72,34.37) v1(57.77,49.37) v1(57.8,9.64) v1(57.87,12.24) v1(57.97,51.1) v1(57.96,10.86) v1(58.33,47.79) v1(58.33,46.68) v1(58.33,45.58) v1(58.33,44.47) v1(58.28,42.33) v1(58.28,41.23) v1(58.28,40.12) v1(58.28,39.02) v1(58.28,36.52) v1(58.41,35.5) v1(58.53,50.13) v1(58.82,34.37) v1(58.91,9.64) v1(58.98,12.24) v1(59.06,10.86) v1(59.35,13.72) v1(59.52,35.5) v1(59.93,34.37) v1(60.01,9.64) v1(60.08,12.24) v1(60.17,10.86) v1(60.32,42.79) v1(60.46,13.72) v1(60.62,35.5) v1(60.62,14.79) v1(61.03,45.08) v1(61.03,34.37) v1(61.08,43.71) v1(61.19,12.24) v1(61.56,13.72) v1(61.73,14.79) v1(62.41,15.86) v1(62.66,13.72) v1(62.84,14.79) v1(63.51,15.86) v1(63.89,16.78) v1(63.94,14.79) v1(64.62,15.86) v1(64.65,44.88) v1(64.91,43.86) v1(64.99,16.78) v1(65.42,70.13) v1(65.47,71.91) v1(65.72,15.86) v1(65.81,73.11) v1(65.89,70.96) v1(66.1,16.78) v1(66.52,70.13) v1(66.57,71.91) v1(67,70.96) v1(67.2,16.78) v1(67.63,70.13) v1(67.68,71.91) v1(68.1,70.96) v1(68.12,18.87) v1(68.73,70.13) v1(68.78,71.91) v1(69.23,18.87) v1(69.45,19.94) v1(69.81,50.44) v1(69.81,49.33) v1(69.81,48.23) v1(69.81,47.12) v1(70.33,18.87) v1(70.62,21.47) v1(70.55,19.94) v1(71.44,18.87) v1(71.73,21.47) v1(71.66,19.94) v1(72.15,51) v1(72.25,49.27) v1(72.25,47.58) v1(72.46,45.75) v1(72.83,21.47) v1(72.76,19.94) v1(73.26,51) v1(73.36,49.27) v1(73.36,47.58) v1(73.56,45.75) v1(73.94,21.47) v1(74.36,51) v1(74.46,49.27) v1(74.46,47.58) v1(74.67,45.75) v1(75.47,51) v1(75.57,49.27) v1(75.57,47.58) v1(75.77,45.75) v1(78.12,49.98) v1(78.12,48.88) v1(78.12,47.77) v1(78.12,46.67) v1(79.24,41.41) v1(80.36,42.94) v1(80.46,41.87) v1(80.97,48.65) v1(80.97,47.55) v1(80.97,46.44) v1(80.97,45.34) v1(81.59,42.33) v1(85.36,25.6) v1(85.77,76.76) v1(86.18,26.62) v1(86.38,73.14) v1(86.64,74.21) v1(86.84,48.45) v1(86.84,44.12) v1(86.88,76.76) v1(86.89,45.54) v1(86.94,38) v1(86.89,36.16) v1(87.09,47.12) v1(87.49,73.14) v1(87.56,28.03) v1(87.74,74.21) v1(87.66,33.2) v1(87.81,34.73) v1(87.81,29.33) v1(87.94,48.45) v1(87.94,44.12) v1(87.98,76.76) v1(88,45.54) v1(88.05,38) v1(88,36.16) v1(88.2,47.12) v1(88.59,73.14) v1(88.84,74.21) v1(89.05,48.45) v1(89.05,44.12) v1(89.09,76.76) v1(89.1,45.54) v1(89.1,36.16) v1(89.15,38) v1(89.3,47.12) v1(89.69,73.14) v1(89.95,74.21) v1(90.15,48.45) v1(90.21,45.54) v1(90.15,44.12) v1(90.21,36.16) v1(90.26,38) v1(90.41,47.12) v1(91.5,36.11) v1(92.5,36.57) v1(94.37,36.11) v1(95.66,36.47) v1(96.58,73.85) v1(97.34,76.16) v1(97.48,73.08) v1(98.44,76.16) v1(98.48,72.06) v1(99.08,71.09) v1(99.55,76.16) v1(100.65,76.16) v1(110.71,76.55) v1(111.81,76.55) v1(112.92,76.55) v1(114.02,76.55) v1(162.01,70.18) v1(163.12,70.18) v1(164.22,70.18) v1(165.07,71.09) v1(165.33,70.18) v1(165.89,76.35) v1(165.94,73.34) v1(166.04,75.07) v1(166.18,71.09) v1(167,76.35) v1(167.05,73.34) v1(167.15,75.07) v1(167.28,71.09) v1(168.1,76.35) v1(168.15,73.34) v1(168.25,75.07) v1(168.39,71.09) v1(169.21,76.35) v1(169.26,73.34) v1(169.36,75.07) v1(171.35,55.49) v1(171.63,65) v1(171.98,47.08) v1(172.19,66.17) v1(172.45,55.49) v1(172.83,46.1) v1(173.64,57.07) v1(173.56,55.49) v1(173.8,47.19) v1(173.93,46.1) v1(174.66,55.49) v1(174.9,47.19) v1(175,59.01) v1(175.04,46.1) v1(175.14,57.43) v1(175.27,56.2) v1(175.33,53.81) v1(175.53,54.83) v1(175.58,57.94) v1(176.01,47.19) v1(176.14,46.1) v1(176.38,56.2) v1(176.43,53.81) v1(176.63,54.83) v1(177.11,64.87) v1(177.48,56.2) v1(177.54,53.81) v1(177.74,54.83) v1(178.59,56.2) v1(178.64,53.81) v1(178.84,54.83) v1(179.56,64.52) v1(179.92,65.54) v1(180.83,65.89) v1(180.78,64.72)
SGND: length 299
  Top Layer w0.254: 124.1,55.14 124.19,55.04 v1(124.19,52.68) ; 123.74,47.66 123.74,47.63 124.55,46.82 125.52,46.82 126.46,47.76 v1(127.28,47.76)
  Top Layer w0.3: v1(122.24,50.34) 122.24,48.81 123.4,47.66 123.74,47.66 ; v1(122.24,50.34) 119.79,47.89 v1(119.07,47.89) ; v1(122.24,50.34) 122.4,50.34 v1(123.09,49.65) ; 134.42,54.42 134.06,54.42 C4.1 132.98,53.07 131.13,51.22 U14.18 ; v1(130.9,36.11) 131.13,36.33 U14.63 131.13,43.96 v1(131.45,44.29) 132.38,45.22 U14.12 ; C50.1 118.64,39.94 118.92,40.22 U14.47 ; U18.7 105.12,53.93 v1(106.46,53.93) ; U14.31 124.63,48.07 123.96,47.41 ; v1(144.83,49.22) 142.89,49.22 140.8,47.13 140.8,46.81 C10.1 ; C20.1 108.67,53.21 v1(108.04,53.83)
  Top Layer w0.4: U9.2 v1(168.24,27.34)
  Top Layer w0.5: 102.09,62.68 102.45,63.04 v1(112.03,63.04) ; C9.2 167.9,19.42 U13.1
  Top Layer w0.6: v1(121.88,55.59) 122.66,55.59 C5.1 ; 102.09,62.68 101.79,62.38 U19.4 100.45,61.55 v1(100.3,61.4) ; U18.7 103.76,53.95 v1(103.57,53.75) 102.57,53.75 102.54,53.79 ; P14.1 114.34,57.21 114.12,57.43 C14.2 113.13,58.48 112.8,58.8 112.8,60.64 v1(113.67,61.51)
  Top Layer w0.8: U16.8 157.61,57.97 v1(157.42,57.78) 157.42,48.45 ; U17.8 v1(126.11,60.03) ; C13.2 129.53,57.38 v1(129.32,57.17) ; C44.1 95.65,54.47 C43.1 93.12,50.39 U24.4 ; v1(110.55,64.62) 107.93,67.24 P17.1 ; v1(142.02,60.03) 140.94,60.03 ; R40.2 123.27,55.14 C5.1 ; v1(162.32,48.35) 162.13,48.54 Q3.3 161.06,46.63 R43.2
  Top Layer w1: C9.2 172.02,23.66 172.02,30.96 ; v1(162.98,31.01) 162.98,31.73 162.25,32.46 162.25,30.53 160.23,28.52 160.23,26.48 C8.2 ; P16.3 P16.4 ; U25.1 105.15,50.03 v1(103.57,50.03)
  Top Layer w1.5: U23.4 92.55,42.26 U24.4
  Bottom Layer w0.254: v1(127.28,47.76) 127.36,47.84 127.36,52.68 v1(124.19,52.68)
  Bottom Layer w0.3: 117.13,46.1 118.92,47.89 v1(119.07,47.89) ; v1(108.04,53.83) 107.94,53.93 v1(106.46,53.93)
  Bottom Layer w0.5: v1(144.83,49.22) 147.68,49.22 148.75,50.29 148.75,54.67 148.04,55.39 v1(147.43,55.39)
  Bottom Layer w0.6: v1(100.3,61.4) 100.3,57.02 v1(103.57,53.75) ; 121.83,60.08 121.88,60.03 v1(121.88,55.59)
  Bottom Layer w0.8: v1(129.32,57.17) 129.32,60.02 ; v1(126.11,60.03) 126.46,60.03 ; 126.46,60.03 126.47,60.02 129.32,60.02 129.33,60.03 v1(142.02,60.03) 155.17,60.03 v1(157.42,57.78) ; 126.46,60.03 126.42,60.08 115.09,60.08 v1(113.67,61.51) v1(110.55,64.62) ; 162.32,48.4 v1(157.42,48.4)
  Bottom Layer w1: v1(100.3,61.4) 99.59,60.69 99.59,49.42 100.35,48.65 100.35,39.42 99.54,38.61 95.71,38.61 92.51,41.81 U23.4 ; v1(168.24,27.34) 171.86,30.96 172.02,30.96 171.97,31.01 v1(162.98,31.01) ; v1(103.57,53.75) v1(103.57,50.03)
  vias: v1(92.6,47.05) v1(92.58,44.95) v1(92.63,43.83) v1(92.68,48.57) v1(93.09,52.25) v1(93.59,48.98) v1(93.59,47.69) v1(93.65,46.38) v1(93.78,44.67) v1(93.86,42.59) v1(94.05,53.01) v1(98.34,45.72) v1(99.05,44.49) v1(100.63,43.88) v1(101.5,43.58) v1(101.55,41.94) v1(102.88,64.54) v1(104.1,64.54) v1(104.71,26.24) v1(105.27,64.54) v1(105.63,27.1) v1(105.94,22) v1(106.5,20.07) v1(106.6,23.13) v1(106.7,64.54) v1(106.8,21.19) v1(107.11,22.31) v1(107.21,23.89) v1(108.03,45.11) v1(108.03,23.13) v1(108.18,19.5) v1(108.28,20.63) v1(108.74,22) v1(108.82,44.41) v1(108.95,22.97) v1(109.13,37.69) v1(109.51,21.29) v1(109.56,10.07) v1(109.71,19.56) v1(109.92,43.37) v1(110.22,38.17) v1(110.17,20.37) v1(110.73,38.98) v1(110.68,21.65) v1(110.88,42.4) v1(111.09,9.71) v1(111.9,41.64) v1(116.16,38.15) v1(116.42,39.02) v1(117.49,17.19) v1(118.47,40.94) v1(118.51,17.8) v1(118.94,58.27) v1(119.86,10.73) v1(121.19,9.56) v1(121.65,57.45) v1(121.98,37.23) v1(122.23,38.51) v1(122.59,37.94) v1(123.43,32.82) v1(123.79,31.95) v1(123.99,33.48) v1(123.97,22.75) v1(124.17,43.98) v1(125.04,44.06) v1(125.65,23.87) v1(127.84,41.06) v1(128.35,41.62) v1(129.02,33.35) v1(128.97,32.44) v1(129.12,42.13) v1(129.17,41.11) v1(130.57,33.2) v1(130.9,35.39) v1(131.28,24.09) v1(131.79,25.06) v1(132.51,23.99) v1(132.69,31.16) v1(132.69,30.45) v1(132.76,50.61) v1(132.79,36.36) v1(133.22,25.17) v1(133.43,51.28) v1(133.5,35.8) v1(133.56,36.57) v1(133.61,30.7) v1(133.73,47.96) v1(134.5,56.63) v1(134.5,54.34) v1(135.42,48.52) v1(135.62,54.85) v1(136.28,49.44) v1(136.49,55.77) v1(136.59,26.08) v1(136.89,25.27) v1(137.1,24.4) v1(137.53,56.51) v1(137.99,40.24) v1(138.43,33.22) v1(138.53,39.19) v1(138.48,11.29) v1(138.63,49.7) v1(138.73,10.48) v1(138.83,51.18) v1(139.24,32.46) v1(139.39,38.58) v1(139.8,26.8) v1(139.85,49.65) v1(139.96,50.46) v1(140.26,37.51) v1(140.57,31.85) v1(140.62,26.03) v1(140.72,50) v1(141,47.21) v1(141.74,31.39) v1(142.2,11.29) v1(142.71,60) v1(142.87,18.83) v1(143.28,17.15) v1(143.69,18.17) v1(145.02,58.67) v1(146.1,31.42) v1(147.07,32.18) v1(147.45,58.72) v1(147.63,33.15) v1(149.67,40.9) v1(150.34,40.95) v1(150.82,45.31) v1(151.02,46.69) v1(151.53,46.18) v1(170.2,12.26) v1(171.12,13.13) v1(171.93,25.68) v1(172.05,27.77) v1(172.07,13.94) v1(172.97,14.66) v1(173.97,27.61) v1(173.96,25.93) v1(175.66,28.63) v1(175.76,26.54) v1(176.37,29.76) v1(176.91,30.37) v1(176.91,28.63) v1(177.02,26.54) v1(178.17,30.37) v1(178.17,28.63) v1(178.27,26.54) v1(179.43,30.37) v1(179.43,28.63) v1(179.53,26.54)
(no net): length 26.3
  Top Layer w0.4: H2.1 168.01,69.25 152.03,69.25 149.99,67.21 U16.15 ; 148.72,57.07 149.99,58.34 U16.2
A_LIMT: length 37.1
  Top Layer w0.3: U4.4 101.03,18.59 R8.2 101.4,20.49 111.6,30.69 111.6,35.36 119.96,43.72 U14.40
A_LO: length 16.5
  Top Layer w0.4: v1(90.97,8.52) 91.07,8.41 92.82,8.41 92.85,8.39 P5.2 ; U4.2 91.51,16.05 v1(89.9,14.43)
  Bottom Layer w0.4: v1(90.97,8.52) 89.9,9.59 v1(89.9,14.43)
ADC: length 38.5
  Top Layer w0.3: 125.64,56.43 126.63,55.44 U14.27
  Top Layer w0.5: 125.64,56.43 119.46,56.43 v1(118.92,56.97) ; P17.2 105.39,67.95 v1(108.76,64.59)
  Bottom Layer w0.5: v1(118.92,56.97) 116.38,56.97 v1(108.76,64.59)
BEEP: length 23.6
  Top Layer w0.3: v1(136.04,45.02) 135.74,44.72 U14.11 ; v1(153.59,46.28) R42.2
  Bottom Layer w0.3: v1(136.04,45.02) 139.13,48.12 151.75,48.12 v1(153.59,46.28)
BOOT0: length 7.2
  Top Layer w0.3: U14.60 129.63,35.91 v1(129.88,35.65) ; v1(129.88,32.28) 129.88,30.84 129.75,30.7
  Bottom Layer w0.3: v1(129.88,35.65) v1(129.88,32.28)
BOOT1: length 4.7
  Top Layer w0.3: R40.1 125.23,52.25 126.13,51.35 U14.28
D+: length 8.8
  Top Layer w0.3: U14.45 123.7,41.22 v1(123.81,41.11)
  Bottom Layer w0.3: v1(123.81,41.11) 123.81,37.49 121.55,35.22 v2(121.55,35)
D-: length 9
  Top Layer w0.3: v2(119.01,35) 120.86,36.85 v1(120.86,36.98) ; v1(120.6,41.57) 120.76,41.72 U14.44
  Bottom Layer w0.3: v1(120.6,41.57) 120.86,41.31 v1(120.86,36.98)
DOOR: length 26.7
  Top Layer w0.3: v1(143.3,22.75) R35.2 142.31,22.64 142.31,20.55 ; U14.2 135.41,40.22 v1(143.19,32.44)
  Bottom Layer w0.3: v1(143.3,22.75) 144.27,23.72 144.27,31.37 v1(143.19,32.44)
EXIO: length 43.1
  Top Layer w0.3: U14.51 125.13,28.07 114.66,17.59 102.04,17.59 101.4,16.95 R19.2 101.4,14.71 100.01,13.32 U5.4
HOLD: length 32.1
  Top Layer w0.3: U14.52 125.63,27.55 113.59,15.5 R34.2 110.84,13.37 U11.4
I_PROBE: length 10.5
  Top Layer w0.4: U27.2 157.12,8.98 157.73,8.36 D12.2 158.43,7.76 157.75,7.09 P10.2
LASER_CD: length 3.3
  Top Layer w0.3: U18.3 101.81,59.03 U19.2
LASER_CTRL: length 14.6
  Top Layer w0.3: U14.26 127.13,55.86 125.89,57.09 123.19,57.09 121.71,58.57 121.71,60.03 U17.5
LASER_OUT: length 41.2
  Top Layer w0.5: v1(85.3,67.8) 92.59,67.8 98.1,62.29 98.1,59.8 97.31,59.01 U19.7 ; 63.91,67.75 67.65,67.75 v1(67.7,67.8)
  Bottom Layer w0.5: v1(67.7,67.8) v1(85.3,67.8)
LASER_PO: length 71
  Top Layer w0.4: v1(86.53,53.7) 68.12,53.7 v1(67.97,53.55) ; R55.2 67.43,61.33 v1(67.41,61.3) ; v1(94.62,55.41) 95.81,56.61 97.24,56.61 99.08,58.45 99.08,61.76 101.07,63.75 121.21,63.75 121.72,64.26 U17.12
  Bottom Layer w0.4: v1(86.53,53.7) 88.24,55.41 v1(94.62,55.41) ; v1(67.97,53.55) 67.41,54.11 v1(67.41,61.3)
LED_SYS: length 11.8
  Top Layer w0.3: v1(127.38,30.8) 127.13,31.06 U14.55 ; D15.2 122.83,30.5 v1(124.32,30.5)
  Bottom Layer w0.3: v1(124.32,30.5) 127.08,30.5 v1(127.38,30.8)
M_EN_OUT: length 55.4
  Top Layer w0.4: U17.10 v1(124.26,69.69)
  Bottom Layer w0.4: P21.1 163.94,74.1 162.03,76.01 150.67,76.01 ; P19.1 137.09,75.9 136.97,76.01 ; 150.51,73.85 150.51,75.86 150.67,76.01 ; 150.67,76.01 136.97,76.01 ; P18.1 123.66,74.15 125.52,76.01 136.97,76.01 ; 123.66,73.85 123.66,72.45 124.26,71.85 v1(124.26,69.69)
MOTOR_EN: length 14
  Top Layer w0.3: U17.7 124.26,58.88 124.81,58.33 R39.1 127.58,56.84 ; 127.58,56.84 128.13,56.29 U14.24
MX_DIR: length 24.2
  Top Layer w0.254: U14.42 123.66,42.72 v1(123.68,42.74) ; 133.32,60.03 133.32,57.83 v1(132.46,56.97)
  Bottom Layer w0.254: v1(123.68,42.74) 126.03,42.74 127.97,44.68 127.97,52.48 v1(132.46,56.97)
MX_DIR_OUT: length 20.1
  Top Layer w0.4: 118.58,73.85 118.58,73.6 121.78,70.4 131.5,70.4 133.32,68.59 133.32,65.51
MX_ST_OUT: length 19.7
  Top Layer w0.4: 121.12,73.85 121.12,72.58 122.48,71.22 132.32,71.22 134.59,68.95 134.59,65.51
MX_STEP: length 14.1
  Top Layer w0.3: 134.59,60.03 134.59,58.05 132.86,56.31 131.11,56.31 129.13,54.33 U14.22
MY_DIR: length 14.3
  Top Layer w0.254: U14.17 131.63,50.84 133.07,52.28 134.19,52.28 138.4,56.49 138.4,60.03
